# Altium schematic sheet 1_Overview.SchDoc
size A
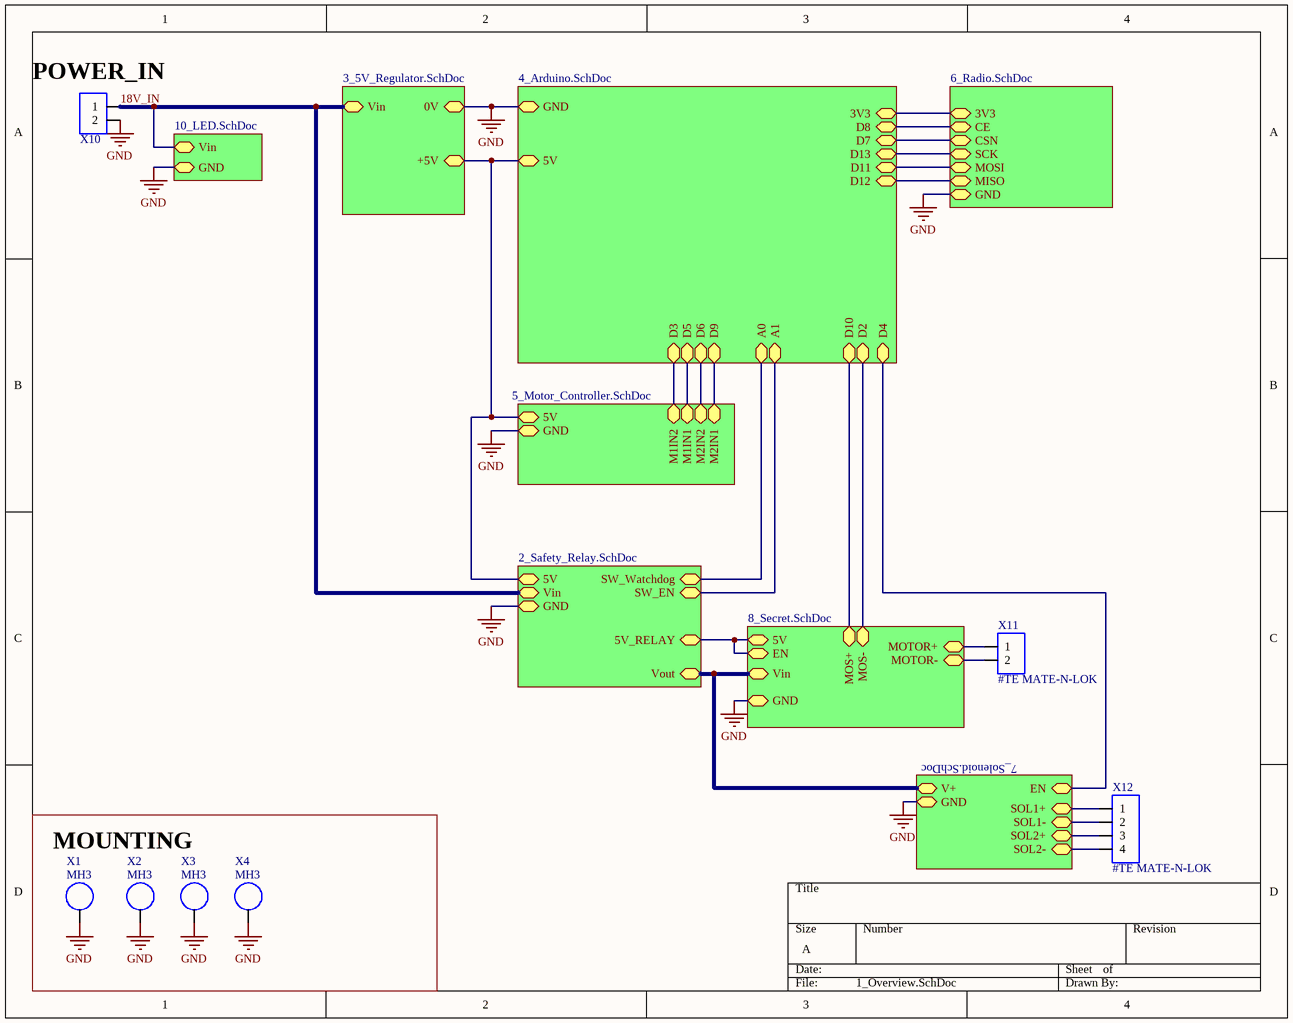
[diagram p0: 1_Overview.SchDoc]

## Parts
X1  MH3  [MH-M3-SEMS-6.7-3.6-Vias-Unplated]  (no BOM)
X2  MH3  [MH-M3-SEMS-6.7-3.6-Vias-Unplated]  (no BOM)
X3  MH3  [MH-M3-SEMS-6.7-3.6-Vias-Unplated]  (no BOM)
X4  MH3  [MH-M3-SEMS-6.7-3.6-Vias-Unplated]  (no BOM)
X10  CONN2_12AWG_Hole  [2_Wire_12AWG]  (value not drawn)  (no BOM)
X11  #TE MATE-N-LOK  [HDR-6.35-2-MATENLOK]  (no BOM)
X12  #TE MATE-N-LOK  [HDR-3.0-4X1-MICROMATENLOK-VERT]  (no BOM)

## Blocks framed on the sheet
MOUNTING: X1-X4

## Sub-sheets
? = 3_5V_Regulator.SchDoc: Vin, 0V, +5V
? = 4_Arduino.SchDoc: 5V, GND, D3, D5, D6, D9, 3V3, D8, D7, D13, D11, D12, D10, D4, A0, A1, D2
? = 6_Radio.SchDoc: GND, 3V3, CE, CSN, SCK, MOSI, MISO
? = 5_Motor_Controller.SchDoc: M1IN1, M1IN2, M2IN1, M2IN2, 5V, GND
? = 2_Safety_Relay.SchDoc: Vin, GND, Vout, SW_Watchdog, SW_EN, 5V_RELAY, 5V
? = 7_Solenoid.SchDoc: EN, V+, GND, SOL1+, SOL1-, SOL2+, SOL2-
? = 8_Secret.SchDoc: MOTOR-, EN, Vin, GND, 5V, MOTOR+, MOS+, MOS-
? = 10_LED.SchDoc: GND, Vin

## Nets
GND: X1.1 X2.1 X3.1 X4.1 X10.2 ; sheet /0V, sheet /GND, sheet /GND, sheet /GND, sheet /GND, sheet /GND, sheet /GND, sheet /GND
18V_IN: X10.1 ; sheet /Vin, sheet /Vin, sheet /Vin
NetX11_1: X11.1 ; sheet /MOTOR+
NetX11_2: X11.2 ; sheet /MOTOR-
NetX12_1: X12.1 ; sheet /SOL1+
NetX12_2: X12.2 ; sheet /SOL1-
NetX12_3: X12.3 ; sheet /SOL2+
NetX12_4: X12.4 ; sheet /SOL2-
(unnamed): sheet /+5V, sheet /5V, sheet /5V, sheet /5V
(unnamed): sheet /D3, sheet /M1IN2
(unnamed): sheet /D5, sheet /M1IN1
(unnamed): sheet /D6, sheet /M2IN2
(unnamed): sheet /D9, sheet /M2IN1
(unnamed): sheet /3V3, sheet /3V3
(unnamed): sheet /D8, sheet /CE
(unnamed): sheet /D7, sheet /CSN
(unnamed): sheet /D13, sheet /SCK
(unnamed): sheet /D11, sheet /MOSI
(unnamed): sheet /D12, sheet /MISO
(unnamed): sheet /D10, sheet /MOS+
(unnamed): sheet /D4, sheet /EN
(unnamed): sheet /A0, sheet /SW_Watchdog
(unnamed): sheet /A1, sheet /SW_EN
(unnamed): sheet /D2, sheet /MOS-
(unnamed): sheet /Vout, sheet /V+, sheet /Vin
(unnamed): sheet /5V_RELAY, sheet /EN, sheet /5V

## Notes on the sheet
- (near X10) POWER_IN

## Library data of the parts
X1-X4 = 7545: MOUNTING HOLE; Part Field 1: MH3 Loose Unplated with Vias; IPN: 7545; Lead_Process_Compatible: Yes; SubmittedBy: zad; DeviceRank: 2; Part Field 2: - -; ComponentLink1Description: -; ComponentLink2Description: Compliant; ComponentLink1URL: -; ComponentLink2URL: -; Altium_Comment_Old: MH3 Loose Unplated with Vias; Altium_Comment: MH3; Symbol: MOUNTING-HOLE; Manufacturer: -; PartNumber: -; LastChanged: 24/06/14 18:13:23; IPN_Search: 7545; OrderNumber: -; PartType: PCB; CheckedBy: vhq
X10 = -: Symbol: CONN2; Lead_Process_Compatible: Yes; SubmittedBy: ZMZE; DeviceRank: 2; IPN: -; Part Field 1: CONN2_12AWG_Hole; Part Field 2: -; Altium_Comment_Old: CONN2_12AWG_Hole; Altium_Comment: CONN2_12AWG_Hole; Manufacturer: -; PartNumber: -; LastChanged: 27/09/12 10:20:42; Supplier1: -; Supplier1_PartNumber: -; Supplier2: -; Supplier2_PartNumber: -; IPN_Search: -; Characteristics: -; OrderNumber: -; PartType: PCB; Price: -; CheckedBy: -; Price_100: -; Price_1000: -; Price_5000: -
X11 = 5732: Connector 2 pin general; Part Field 1: CONN2 2x1 6.35mm MATE-N-LOK Pin Header Shrouded Vert RoHS; Manufacturer: TYCO; PartNumber: 350786-1; IPN: 5732; EndOfLife: Active EOL:May 2023; Characteristics: TIN Imax10AWG = 19A Vmax = 600V -55..+105; Lead_Process_Compatible: Yes; SubmittedBy: BWJ; DeviceRank: 2; Part Field 2: TYCO 350786-1; ComponentLink1Description: ENG_CD_350786_R2.pdf; ComponentLink2Description: Tyco_350786_MD.pdf; ComponentLink1URL: http://ecad.vsl.com.au/apps/BomGen/Data/rel/datasheets/new_parts/ENG_CD_350786_R2.pdf; ComponentLink2URL: http://ecad.vsl.com.au/apps/BomGen/Data/rel/rohs_compliance/new_certificates/Tyco_350786_MD.pdf; Altium_Comment_Old: CONN2 2x1 6.35mm MATE-N-LOK Pin Header Shrouded Vert RoHS; Altium_Comment: #TE MATE-N-LOK; Symbol: CONN2; LastChanged: 24/02/12 18:41:43; Supplier1: Farnell; Supplier1_PartNumber: 750232; Supplier2: Digikey; Supplier2_PartNumber: A14314-ND; IPN_Search: 5732; OrderNumber: 350786-1; PartType: PCB; Price: 0.76; CheckedBy: LGG; Price_100: M$0.502; Price_1000: M$0.327; Price_5000: M$0.327
X12 = 5975: Connector 4 pin general; Part Field 1: CONN4 4X1 3mm Micro MATE-N-LOK VERT; Manufacturer: TE Connectivity; PartNumber: 2-1445094-4; IPN: 5975; EndOfLife: Active EOL:Jul 2022; Characteristics: Ur=250Vac Imax=5A UL 94V-0 260C 0.30um gold; Lead_Process_Compatible: Yes; SubmittedBy: SAA; DeviceRank: 2; Part Field 2: TE Connectivity 2-1445094-4; ComponentLink1Description: TE Connectivity_2-1445094-4_ENG_CD_1445094_A2.pdf; ComponentLink2Description: TE Connectivity_2-1445094-4_RoHS_Compliance_130325_204622.pdf; ComponentLink1URL: http://ecad.vsl.com.au/apps/BomGen/Data/rel/datasheets/TE Connectivity/TE Connectivity_2-1445094-4_ENG_CD_1445094_A2.pdf; ComponentLink2URL: http://ecad.vsl.com.au/apps/BomGen/Data/rel/rohs_compliance/new_certificates/TE Connectivity_2-1445094-4_RoHS_Compliance_130325_204622.pdf; Altium_Comment_Old: CONN4 4X1 3mm Micro MATE-N-LOK VERT; Altium_Comment: #TE MATE-N-LOK; Symbol: CONN4; LastChanged: 06/05/14 13:09:13; Supplier1: mouser; Supplier1_PartNumber: 2-1445094-4; IPN_Search: 5975; OrderNumber: 2-1445094-4; PartType: PCB; Price: 1.06; CheckedBy: vhq; Price_100: M$0.786; Price_1000: M$0.700; Price_5000: M$0.633